# Altium schematic sheet CaRe_Schematic_SMD_6.29.SchDoc: Infant CaRe Monitor PCB
size C; Date: 3.3.13; DrawnBy: Caleb Durante; Engineer: Caleb Durante; Organization: UW - Biomedical Engineering; Revision: A; SheetNumber: 1; SheetTotal: 1; PageSetup: Record=PageOptions|CenterHorizontal=True|CenterVertical=True|PrintScale=0.25|XCorrection=1.00|YCorrection=1.00|PrintKind=1|BorderSize=5000000|LeftOffset=0|BottomOffset=0|Orientation=2|PaperLength=1000|PaperWidth=1000|Scale=100|PaperSource=15|PrintQuality=600|MediaType=1|DitherType=10|PaperKind=Letter|PrintScaleMode=1; ProjectName: Infant CaRe Monitor
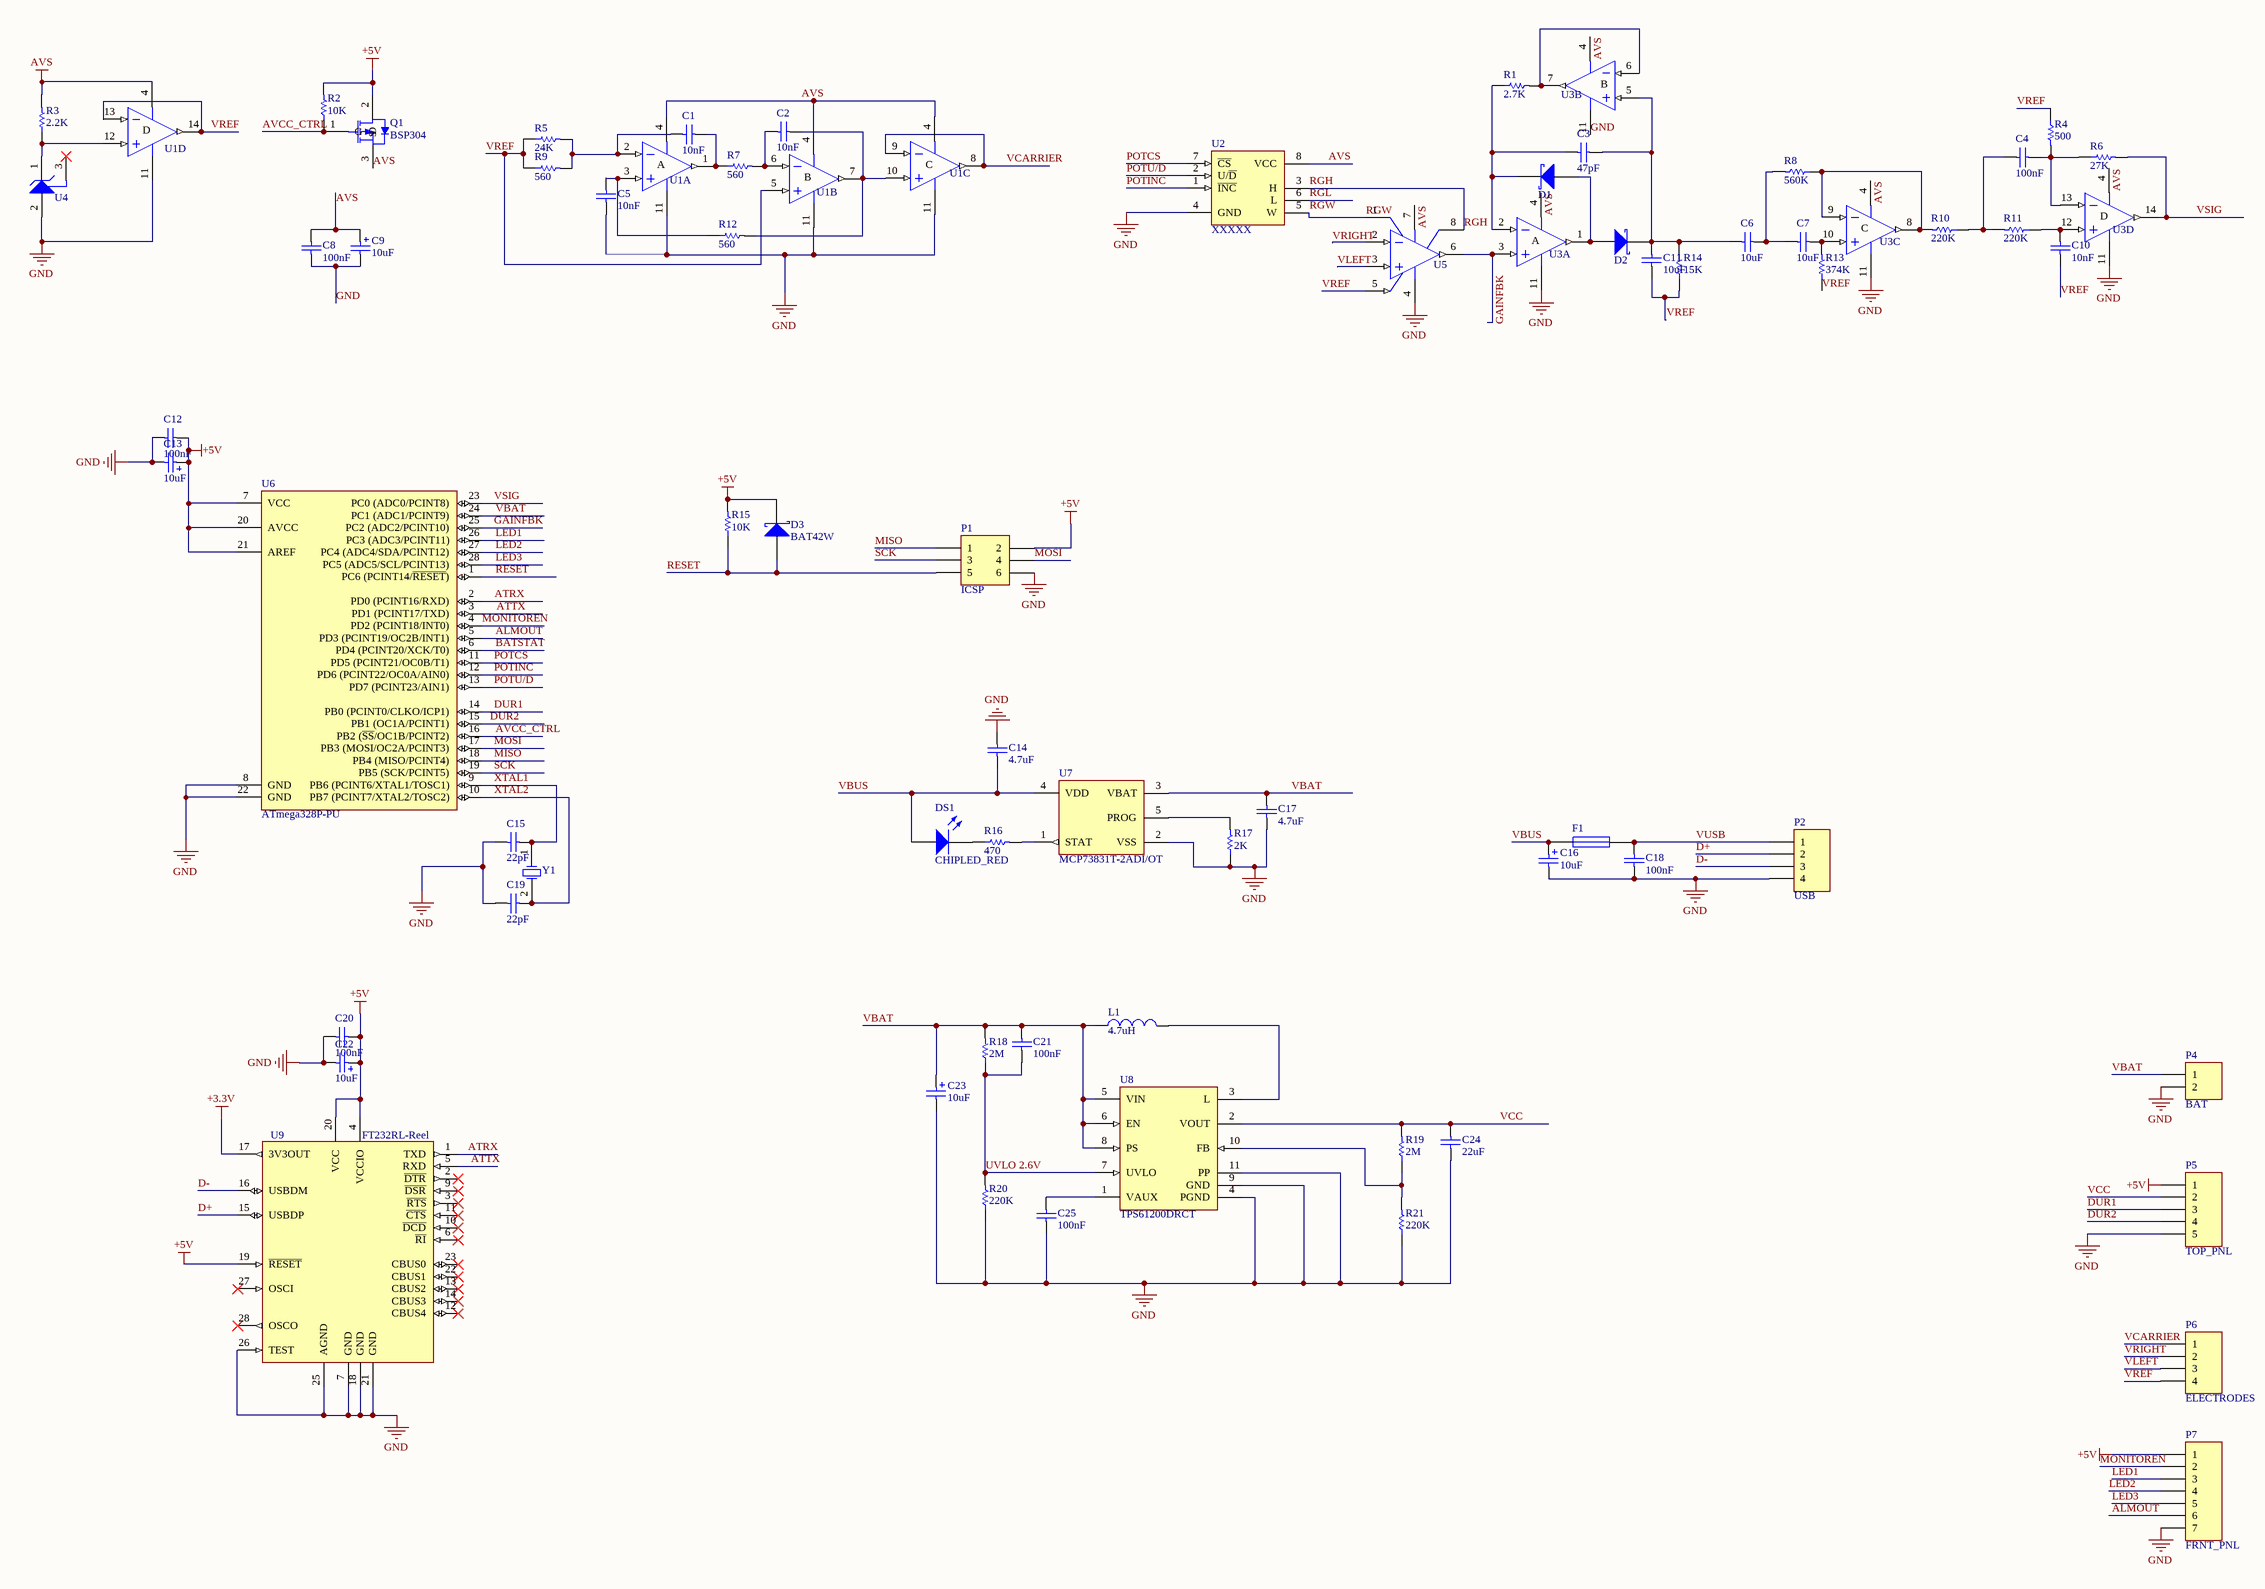
[diagram p0: CaRe_Schematic_SMD_6.29.SchDoc]

## Parts
C1  value 10nF  [CAP0805]  (hidden comment: Capacitor)
C2  value 10nF  [CAP0805]  (hidden comment: Capacitor)
C3  value 47pF  [CAP0805]  (hidden comment: Capacitor)
C4  value 100nF  [CAP0805]  (hidden comment: Capacitor)
C5  value 10nF  [CAP0805]  (hidden comment: Capacitor)
C6  value 10uF  [CAP0805]  (hidden comment: Capacitor)
C7  value 10uF  [CAP0805]  (hidden comment: Capacitor)
C8  value 100nF  [CAP0805]  (hidden comment: Capacitor)
C9  10uF  [0805TANTCAP]
C10  value 10nF  [CAP0805]  (hidden comment: Capacitor)
C11  value 10uF  [CAP0805]  (hidden comment: Capacitor)
C12  value 100nF  [CAP0805]  (hidden comment: Capacitor)
C13  10uF  [0805TANTCAP]
C14  value 4.7uF  [CAP0805]  (hidden comment: Capacitor)
C15  value 22pF  [CAP0805]  (hidden comment: Capacitor)
C16  10uF  [0805TANTCAP]
C17  value 4.7uF  [CAP0805]  (hidden comment: Capacitor)
C18  value 100nF  [CAP0805]  (hidden comment: Capacitor)
C19  value 22pF  [CAP0805]  (hidden comment: Capacitor)
C20  value 100nF  [CAP0805]  (hidden comment: Capacitor)
C21  value 100nF  [CAP0805]  (hidden comment: Capacitor)
C22  10uF  [0805TANTCAP]
C23  10uF  [0805TANTCAP]
C24  value 22uF  [CAP0805]  (hidden comment: Capacitor)
C25  value 100nF  [CAP0805]  (hidden comment: Capacitor)
D1  BAT42W  [SOD-523]  (value not drawn)
D2  BAT42W  [SOD-523]  (value not drawn)
D3  BAT42W  [SOD-523]
DS1  CHIPLED_RED  [CHIP_LED0805]
F1  MF-MSMF050-1  [MF-MSMF050 FOOTPRINT]  (value not drawn)
L1  4.7uH  [INDP4330X10N]
P1  ICSP  [HDR2X3]
P2  USB  [JST 4-Pin SMD]
P4  BAT  [JST-2 Pin SMD Connector]
P5  TOP_PNL  [JST 5 Pin SMD]
P6  ELECTRODES  [JST 4-Pin SMD]
P7  FRNT_PNL  [JST-SH 7-Pin Vertical SMD]
Q1  BSP304  [SOT23_L]
R1  value 2.7K  [RES0805]  (hidden comment: Resistor)
R2  value 10K  [RES0805]  (hidden comment: Resistor)
R3  value 2.2K  [RES0805]  (hidden comment: Resistor)
R4  value 500  [RES0805]  (hidden comment: Resistor)
R5  value 24K  [RES0805]  (hidden comment: Resistor)
R6  value 27K  [RES0805]  (hidden comment: Resistor)
R7  value 560  [RES0805]  (hidden comment: Resistor)
R8  value 560K  [RES0805]  (hidden comment: Resistor)
R9  value 560  [RES0805]  (hidden comment: Resistor)
R10  value 220K  [RES0805]  (hidden comment: Resistor)
R11  value 220K  [RES0805]  (hidden comment: Resistor)
R12  value 560  [RES0805]  (hidden comment: Resistor)
R13  value 374K  [RES0805]  (hidden comment: Resistor)
R14  value 15K  [RES0805]  (hidden comment: Resistor)
R15  value 10K  [RES0805]  (hidden comment: Resistor)
R16  value 470  [RES0805]  (hidden comment: Resistor)
R17  value 2K  [RES0805]  (hidden comment: Resistor)
R18  value 2M  [RES0805]  (hidden comment: Resistor)
R19  value 2M  [RES0805]  (hidden comment: Resistor)
R20  value 220K  [RES0805]  (hidden comment: Resistor)
R21  value 220K  [RES0805]  (hidden comment: Resistor)
U1  TLV274IN  [TI-D14_L]  (value not drawn)  (parts A,B,C,D of 4)
U2  XXXXX  [SOIC-8]
U3  TLV274IN  [TI-D14_L]  (value not drawn)  (parts A,B,C,D of 4)
U4  LM4040  [SOT23_L]  (value not drawn)
U5  LT1920  [LT-S8-8_L(LT1920)]  (value not drawn)
U6  ATmega328P-PU  [28P3]
U7  MCP73831T-2ADI/OT  [SOT-23-OT5_L]
U8  TPS61200DRCT  [DRC10-2400X1650TP]
U9  FT232RL-Reel  [SSOP-28_L(FTDI)]
Y1  ECS-10-3-1  [HC-49U]  (value not drawn)

## Nets
+3.3V: U9.17(3V3OUT)
+5V: C12.1 C13.1 C20.1 C22.1 D3.2 P1.2 P5.1 P7.1 Q1.2(D) R2.2 R15.2 U6.7(VCC) U6.20(AVCC) U6.21(AREF) U9.4(VCCIO) U9.19(~{RESET}) U9.20(VCC)
AVS: C8.2 C9.1 Q1.3(S) R3.2 U1.4(V+) U2.8(VCC) U3.4(V+) U5.7(V+)
GND: C5.1 C8.1 C9.2 C12.2 C13.2 C14.1 C15.1 C16.2 C17.1 C18.1 C19.1 C20.2 C22.2 C23.2 C24.2 C25.1 P1.6 P2.4 P4.2 P5.5 P7.7 R17.1 R20.1 R21.1 U1.11(V-) U2.4(GND) U3.11(V-) U4.2(ANODE) U5.4(V-) U6.8(GND) U6.22(GND) U7.2(VSS) U8.4(PGND) U8.9(GND) U8.11(PP) U9.7(GND) U9.18(GND) U9.21(GND) U9.25(AGND) U9.26(TEST)
ALMOUT: P7.6 U6.5(PD3_(PCINT19/OC2B/INT1))
ATRX: U6.2(PD0_(PCINT16/RXD)) U9.1(TXD)
ATTX: U6.3(PD1_(PCINT17/TXD)) U9.5(RXD)
AVCC_CTRL: Q1.1(G) R2.1 U6.16(PB2_(~{SS}/OC1B/PCINT2))
BATSTAT: U6.6(PD4_(PCINT20/XCK/T0))
D+: P2.2 U9.15(USBDP)
D-: P2.3 U9.16(USBDM)
DUR1: P5.3 U6.14(PB0_(PCINT0/CLKO/ICP1))
DUR2: P5.4 U6.15(PB1_(OC1A/PCINT1))
GAINFBK: U3.3(IN+) U5.6(OUT) U6.25(PC2_(ADC2/PCINT10))
LED1: P7.3 U6.26(PC3_(ADC3/PCINT11))
LED2: P7.4 U6.27(PC4_(ADC4/SDA/PCINT12))
LED3: P7.5 U6.28(PC5_(ADC5/SCL/PCINT13))
MISO: P1.1 U6.18(PB4_(MISO/PCINT4))
MONITOREN: P7.2 U6.4(PD2_(PCINT18/INT0))
MOSI: P1.4 U6.17(PB3_(MOSI/OC2A/PCINT3))
POTCS: U2.7(~{CS}) U6.11(PD5_(PCINT21/OC0B/T1))
POTINC: U2.1(~{INC}) U6.12(PD6_(PCINT22/OC0A/AIN0))
POTU/D: U2.2(U/~{D}) U6.13(PD7_(PCINT23/AIN1))
RESET: D3.1 P1.5 R15.1 U6.1(PC6_(PCINT14/~{RESET}))
RGH: U2.3(H) U5.8(RG)
RGL: U2.6(L)
RGW: U2.5(W) U5.1(RG)
SCK: P1.3 U6.19(PB5_(SCK/PCINT5))
UVLO 2.6V: C21.1 R18.1 R20.2 U8.7(UVLO)
VBAT: C17.2 C21.2 C23.1 L1.1 P4.1 R18.2 U6.24(PC1_(ADC1/PCINT9)) U7.3(VBAT) U8.5(VIN) U8.6(EN) U8.8(PS)
VBUS: C14.2 C16.1 DS1.1(A) F1.2 U7.4(VDD)
VCARRIER: P6.1 U1.8(OUT) U1.9(IN-)
VCC: C24.1 P5.2 R19.2 U8.2(VOUT)
VLEFT: P6.3 U5.3(+IN)
VREF: C10.1 C11.1 P6.4 R4.1 R5.1 R9.1 R13.1 R14.1 U1.5(IN+) U1.13(IN-) U1.14(OUT) U5.5(REF)
VRIGHT: P6.2 U5.2(-IN)
VSIG: R6.2 U3.14(OUT) U6.23(PC0_(ADC0/PCINT8))
VUSB: C18.2 F1.1 P2.1
XTAL1: C15.2 U6.9(PB6_(PCINT6/XTAL1/TOSC1)) Y1.1(OSC1)
XTAL2: C19.2 U6.10(PB7_(PCINT7/XTAL2/TOSC2)) Y1.2(OSC2)
NetC1_1: C1.1 R5.2 R9.2 U1.2(IN-)
NetC1_2: C1.2 R7.1 U1.1(OUT)
NetC2_1: C2.1 R7.2 U1.6(IN-)
NetC2_2: C2.2 R12.2 U1.7(OUT) U1.10(IN+)
NetC3_1: C3.1 C6.2 C11.2 D2.2 R14.2 U3.5(IN+)
NetC3_2: C3.2 D1.2 R1.1 U3.2(IN-)
NetC4_1: C4.1 R10.1 R11.2
NetC4_2: C4.2 R4.2 R6.1 U3.13(IN-)
NetC5_2: C5.2 R12.1 U1.3(IN+)
NetC6_1: C6.1 C7.2 R8.2
NetC7_1: C7.1 R13.2 U3.10(IN+)
NetC10_2: C10.2 R11.1 U3.12(IN+)
NetC25_2: C25.2 U8.1(VAUX)
NetD1_1: D1.1 D2.1 U3.1(OUT)
NetDS1_2: DS1.2(K) R16.1
NetL1_2: L1.2 U8.3(L)
NetR1_2: R1.2 U3.6(IN-) U3.7(OUT)
NetR3_1: R3.1 U1.12(IN+) U4.1(CATHODE)
NetR8_1: R8.1 R10.2 U3.8(OUT) U3.9(IN-)
NetR16_2: R16.2 U7.1(STAT)
NetR17_2: R17.2 U7.5(PROG)
NetR19_1: R19.1 R21.2 U8.10(FB)

Not connected (* = marked no-connect by the designer): U4 3(NC)*; U9 2(~{DTR})* 3(~{RTS})* 6(~{RI})* 8(NC) 9(~{DSR})* 10(~{DCD})* 11(~{CTS})* 12(CBUS4)* 13(CBUS2)* 14(CBUS3)* 22(CBUS1)* 23(CBUS0)* 24(NC) 27(OSCI)* 28(OSCO)*

## Notes on the sheet
- Title
- Size:
- Date:
- B
- Number:
- Time:
- Revision:
- Sheet
- of
- File:
- (in symbol TLV274IN, part A) A
- (in symbol TLV274IN, part B) B
- (in symbol TLV274IN, part C) C
- (in symbol TLV274IN, part D) D

## Library data of the parts
C1-C8 C10-C12 C14 C15 C17-C21 C24 C25 = Chip Cap: Published: 8-Jun-2000; LatestRevisionDate: 17-Jul-2002; LatestRevisionNote: Re-released for DXP Platform.; PackageReference: RAD-0.3; Publisher: Altium Limited; PackageDescription: Radial Cap, Thru-Hole; 2 Leads; 0.3 in Pin Spacing
C9 C13 C16 C22 C23 = Cap Tant: Polarized Capacitor (Radial); Manufacturer: AVX; Part Number: TAJP106M010RNJ; Published: 8-Jun-2000; LatestRevisionDate: 17-Jul-2002; LatestRevisionNote: Re-released for DXP Platform.; PackageReference: RB7.6-15; Publisher: Altium Limited; PackageDescription: Polarized Capacitor (Radial); 2 Leads; Value: 10uF
D1-D3 = BAT42W: Schottky Diode; Manufacturer: Vishay; Published: 8-Jun-2000; LatestRevisionDate: 17-Jul-2002; LatestRevisionNote: Re-released for DXP Platform.; PackageReference: SMB; Publisher: Altium Limited; PackageDescription: DO-214-AA/SMB; 2 C-Bend Leads; Body 5.3 x 3.6 mm, inc. leads (LxW); Code_JEDEC: DO-214-AA
DS1 = CHIPLED_RED: Typical RED LED; Part Number: P_100_LTST-C170KRKT; Published: 8-Jun-2000; LatestRevisionDate: 08-Jul-2005; LatestRevisionNote: Mech Layer 1 removed.; PackageReference: LED-1; Publisher: Altium Limited; PackageDescription: LED; 2 Leads
F1 = PTC Fuse: PTC Resettable Fuse 500 mA; Published: 8-Jun-2000; LatestRevisionDate: 17-Jul-2002; LatestRevisionNote: Re-released for DXP Platform.; PackageReference: PIN-W2/E2.8; Publisher: Altium Limited; PackageDescription: Thru-Hole; 2 Leads; PartNumber: MF-MSMF050-1
L1 = Inductor: Code_IEC: 1005; Published: 8-Jun-2000; LatestRevisionDate: 29-May-2009; LatestRevisionNote: IPC-7351 Footprint Added.; PackageReference: 0402-A; Publisher: Altium Limited; PackageDescription: Chip Inductor; Code_JEITA: 0402; Value: 4.7uH
P1 = Header 3X2: Header, 3-Pin, Dual row; LatestRevisionDate: 17-Jul-2002; LatestRevisionNote: Re-released for DXP Platform.; Publisher: Altium Limited
P2 P6 = Header 4: Header, 4-Pin; LatestRevisionDate: 17-Jul-2002; LatestRevisionNote: Re-released for DXP Platform.; Publisher: Altium Limited
P4 = Header 2: Header, 2-Pin; LatestRevisionDate: 17-Jul-2002; LatestRevisionNote: Re-released for DXP Platform.; Publisher: Altium Limited
P5 = Header 5: Header, 5-Pin; LatestRevisionDate: 17-Jul-2002; LatestRevisionNote: Re-released for DXP Platform.; Publisher: Altium Limited
P7 = Header 7: Header, 7-Pin; LatestRevisionDate: 17-Jul-2002; LatestRevisionNote: Re-released for DXP Platform.; Publisher: Altium Limited
Q1 = BSP304: P-channel Enhancement Mode Vertical D-MOSFET; Published: 17-Sep-2003; LatestRevisionDate: 12-Dec-2006; LatestRevisionNote: Footprint pad sequence fixed.; DatasheetVersion: 7-Apr-1995; PackageVersion: Feb-1997; PackageReference: TO-92_variant; Publisher: Altium Limited; PackageDescription: Plastic single-ended leaded (through hole) package; 3 leads on-circle; Code_JEITA: SC-43; Code_JEDEC: TO-92 Variant; ComponentLink1Description: Manufacturer Link; ComponentLink1URL: http://www.semiconductors.philips.com/; ComponentLink2Description: Datasheet; ComponentLink2URL: http://www.semiconductors.philips.com/acrobat/datasheets/BSP304_1.pdf
R1-R21 = Chip Res: Published: 8-Jun-2000; LatestRevisionDate: 17-Jul-2002; LatestRevisionNote: Re-released for DXP Platform.; PackageReference: AXIAL-0.3; Publisher: Altium Limited; PackageDescription: Axial Device, Thru-Hole; 2 Leads; 0.3 in Pin Spacing
U1 U3 = TLV274IN: JFET-Input Operational Amplifier; Published: 16-Jan-2001; LatestRevisionDate: 04-Mar-2005; LatestRevisionNote: Stylized 3D Model Added.; DatasheetVersion: Feb-1999; PackageVersion: Oct-1995; PackageReference: N014; Publisher: Altium Limited; PackageDescription: DIP; 14 Leads; Row Spacing 7.62 mm; Pitch 2.54 mm; ComponentLink1Description: Manufacturer Link; ComponentLink1URL: http://www.ti.com/; ComponentLink2Description: Datasheet
U2 = DS1804-050: Nonvolatile Trimmer Potentiometer; Published: 13-Oct-2000; LatestRevisionDate: 17-Jul-2002; LatestRevisionNote: Re-released for DXP Platform.; DatasheetVersion: 26-Oct-1999; PackageVersion: 1999; PackageReference: DIP8; Publisher: Altium Limited; PackageDescription: DIP, 8-Pin, Row Spacing 7.62 mm, Pitch 2.54 mm; ComponentLink1Description: Manufacturer Link; ComponentLink1URL: http://www.maxim-ic.com/; ComponentLink2Description: Datasheet; ComponentLink2URL: http://pdfserv.maxim-ic.com/en/ds/DS1804.pdf
U4 = LM4040: Precision Micropower Shunt Voltage Reference, 0.1% accuracy, 2.5 V, 15 ppm / degC, 15 mA, -40 to 85 degC, 3-pin SOT-23 (DBZ), Green (RoHS & no Sb/Br); PartNumber: LM4040A25IDBZR; Manufacturer: Texas Instruments; Initial Accuracy @ 25/deg C(%): 0.1; Iout/Iz(Max)(mA): 15; Min Iz for Regulation(uA): 75; Rating: Catalog; Temp Coeff(Max)(ppm/ degree C): 100; VO(V): 2.5; DatasheetVersion: SLOS456K; PackageVersion: 4203227/B; PackageReference: DBZ3; PackageDescription: 3-Pin Plastic Small Outline, Body 2.92 x 1.3 mm, Pitch 0.95 mm; Supplier 1: Digi-Key; Supplier Part Number 1: 296-20859-2-ND; Code_JEDEC: TO-236; ComponentLink1Description: Manufacturer URL; ComponentLink1URL: http://www.ti.com/; ComponentLink2Description: Datasheet; ComponentLink2URL: http://www.ti.com/general/docs/lit/getliterature.tsp?genericPartNumber=LM4040A25&fileType=pdf; ComponentLink3Description: Package Specification; ComponentLink3URL: http://www.ti.com/litv/pdf/mpds108a; Supplier 2: Digi-Key; Supplier Part Number 2: 296-20859-1-ND; Supplier 3: Digi-Key; Supplier Part Number 3: 296-20859-6-ND; Supplier 4: Newark; Supplier Part Number 4: 53K9323; Supplier 5: Mouser; Supplier Part Number 5: 595-LM4040A25IDBZR; Eco-Plan: Green (RoHS & no Sb/Br); SubFamily: Shunt Voltage Reference; Temp Coeff(Typ)(ppm/ degree C): 15; Mounting Technology: Surface Mount
U5 = AD620AN: Low-Cost, Low-Power Instrumentation Amplifier; Published: 8-Jun-2000; LatestRevisionDate: 04-Mar-2005; LatestRevisionNote: Stylized 3D Model Added.; DatasheetVersion: REV.D 1998; PackageVersion: revA; PackageReference: N-8; Publisher: Altium Limited; PackageDescription: DIP; 8 Leads; Row Spacing 7.62 mm; Pitch 2.54 mm; ComponentLink1Description: Manufacturer Link; ComponentLink1URL: http://www.analog.com/en/prod/0%2C2877%2CAD620%2C00.html; ComponentLink2Description: Datasheet; ComponentLink2URL: http://www.analog.com/UploadedFiles/Data_Sheets/897653854AD620_g.pdf
U6 = ATmega328P-PU: 8-bit AVR Microcontroller, 32KB Flash, 1KB EEPROM, 2KB SRAM, 28-pin PDIP, Industrial Grade (-40°C to 85°C); Published: 1-Apr-2010; DatasheetVersion: revA, Jan-2010; PackageVersion: revB, Sep-2001; PackageReference: 28P3; Publisher: Altium Limited; PackageDescription: 28-lead (0.300"/7.62mm Wide) Plastic Dual Inline Package (PDIP); Supplier 1: Digi-Key; Supplier Part Number 1: ATMEGA328P-PU-ND; Supplier 2: Farnell; Supplier Part Number 2: 1715487; Supplier 3: Mouser; Supplier Part Number 3: 556-ATMEGA328P-PU; ComponentLink1Description: Manufacturer Link; ComponentLink1URL: http://www.atmel.com/products/avr/default.asp?; ComponentLink2Description: ATmega48A/48PA/88A/88PA/168A/168PA/328/328P Datasheet; ComponentLink2URL: http://www.atmel.com/dyn/resources/prod_documents/8271.pdf; ComponentLink3Description: ATmega48A/48PA/88A/88PA/168A/168PA/328/328P Summary; ComponentLink3URL: http://www.atmel.com/dyn/resources/prod_documents/8271S.pdf; ComponentLink4Description: Atmel.com Home; ComponentLink4URL: http://www.atmel.com
U7 = MCP73831T-2ADI/OT: Miniature Single-Cell, Fully Integrated Li-Ion, Li-Polymer Charge Management Controller, 4.2V, 5-Pin SOT-23, Industrial Temperature, Tape and Reel; Manufacturer: Microchip; DatasheetVersion: revE, Sep-2008; PackageVersion: revBB, Aug-2009; PackageReference: SOT-23-OT5; PackageDescription: 5-Lead Plastic Small Outline Transistor (OT) [SOT-23]; Mounting Technology: Surface Mount; Code_IPC: SOT23-5; PartNumber: MCP73831T-2ADI/OT; ComponentLink1Description: Manufacturer URL; ComponentLink1URL: http://www.microchip.com/; ComponentLink2Description: Datasheet; ComponentLink2URL: http://ww1.microchip.com/downloads/en/DeviceDoc/21984e.pdf; ComponentLink3Description: Package Specification; ComponentLink3URL: http://www.microchip.com/stellent/groups/techpub_sg/documents/packagingspec/en012702.pdf
U8 = TPS61200DRCT: Boost Voltage Converter with 0.3 to 5.5 V Input and 1.8 to 5.5 V Output, -40 to 85 degC, 10-Pin SON (DRC), Green (RoHS & no Sb/Br); Manufacturer: Texas Instruments; Regulated Outputs(#): 1; SubFamily: Step-Up Regulator; Switching Frequency(Max)(kHz): 1250; Synchronous Rectification: TRUE; Vin(Max)(V): 5.5; Vin(Min)(V): 0.3; Vout(Min)(V): 1.8; DatasheetVersion: SLVS577B; PackageVersion: revL, Sep-2011; PackageReference: DRC10-2400X1650TP; PackageDescription: 10-Pin Plastic Small Outline No-Lead, 3 x 3 x 1 mm Body, 0.5 mm Pitch, Exposed Pad; Supplier 1: Digi-Key; Supplier Part Number 1: 296-21663-2-ND; Supplier 2: Digi-Key; Supplier Part Number 2: 296-21663-1-ND; Supplier 3: Digi-Key; Supplier Part Number 3: 296-21663-6-ND; Supplier 4: Farnell; Supplier Part Number 4: 1471238; Supplier 5: Newark; Supplier Part Number 5: 37M0066; Eco-Plan: Green (RoHS & no Sb/Br); Topology: Boost; Vout(Max)(V): 5.5; Mounting Technology: Surface Mount; PartNumber: TPS61200DRCT; ComponentLink1Description: Datasheet; ComponentLink1URL: http://www.ti.com/general/docs/lit/getliterature.tsp?genericPartNumber=TPS61200&fileType=pdf; ComponentLink2Description: Package Specification; ComponentLink2URL: http://www.ti.com/litv/pdf/mpds117k; Supplier 6: Mouser; Supplier Part Number 6: 595-TPS61200DRCT
U9 = FT232RL-Reel: USB UART Asynchronous Serial Data Transfer Chip, SSOP-28, Tape and Reel; Published: 19-Aug-2010; DatasheetVersion: ver 2.07, Jul-2010; PackageVersion: 2010; PackageReference: SSOP-28; Publisher: Altium Limited; PackageDescription: 28-Pin Small Outline Package 0.65 mm Pitch; ComponentLink1Description: Manufacturer Link; ComponentLink1URL: http://www.ftdichip.com/Products/ICs/FT232R.htm; ComponentLink2Description: Datasheet; ComponentLink2URL: http://www.ftdichip.com/Support/Documents/DataSheets/ICs/DS_FT232R.pdf
Y1 = ECS-10-13-1: Crystal Oscillator; Published: 17-Jul-2002; DatasheetDocument: 18-Apr-2000; PackageReference: HC-49U; Publisher: Altium Limited; ComponentLink1Description: Manufacturer Link; ComponentLink1URL: http://www.ecsxtal.com/; ComponentLink2Description: Datasheet; ComponentLink2URL: http://www.ecsxtal.com/pdf2/HC49U.PDF